# Altium schematic sheet Power_Adc.SchDoc
size A4
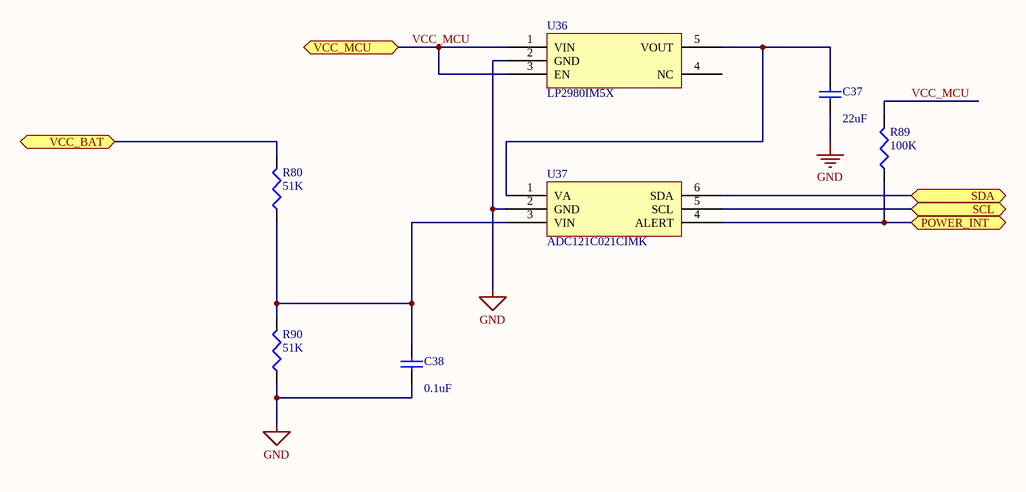
[diagram p0: Power_Adc.SchDoc]

## Parts
C37  value 22uF  [1206]  (hidden comment: Cap Semi)
C38  value 0.1uF  [0603]  (hidden comment: Cap Semi)
R80  value 51K  [0805]  (hidden comment: Res3)
R89  value 100K  [0603]  (hidden comment: Res3)
R90  value 51K  [0805]  (hidden comment: Res3)
U36  LP2980IM5X  [DDC-5]
U37  ADC121C021CIMK  [DDC-6]

## Ports
POWER_INT (bidir), SCL (bidir), SDA (bidir), VCC_BAT (bidir), VCC_MCU (bidir)

## Nets
GND: C37.1 C38.1 R90.1 U36.2(GND) U37.2(GND)
POWER_INT: R89.1 U37.4(ALERT) ; port POWER_INT
SCL: U37.5(SCL) ; port SCL
SDA: U37.6(SDA) ; port SDA
VCC_BAT: R80.2 ; port VCC_BAT
VCC_MCU: R89.2 U36.1(VIN) U36.3(EN) ; port VCC_MCU
NetC37_2: C37.2 U36.5(VOUT) U37.1(VA)
NetC38_2: C38.2 R80.1 R90.2 U37.3(VIN)

Not connected (* = marked no-connect by the designer): U36 4(NC)

## Library data of the parts
C37 C38 = Cap Semi: Capacitor (Semiconductor SIM Model); Published: 8-Jun-2000; LatestRevisionDate: 29-May-2009; LatestRevisionNote: IPC-7351 Footprint Added.; PackageReference: C1206; Publisher: Altium Limited; PackageDescription: Chip Capacitor
R80 R89 R90 = Res3: Resistor; Published: 8-Jun-2000; LatestRevisionDate: 29-May-2009; LatestRevisionNote: IPC-7351 Footprint Added.; PackageReference: J1-0603; Publisher: Altium Limited; PackageDescription: Chip Resistor